# Altium schematic sheet power_supply.SchDoc
size A4
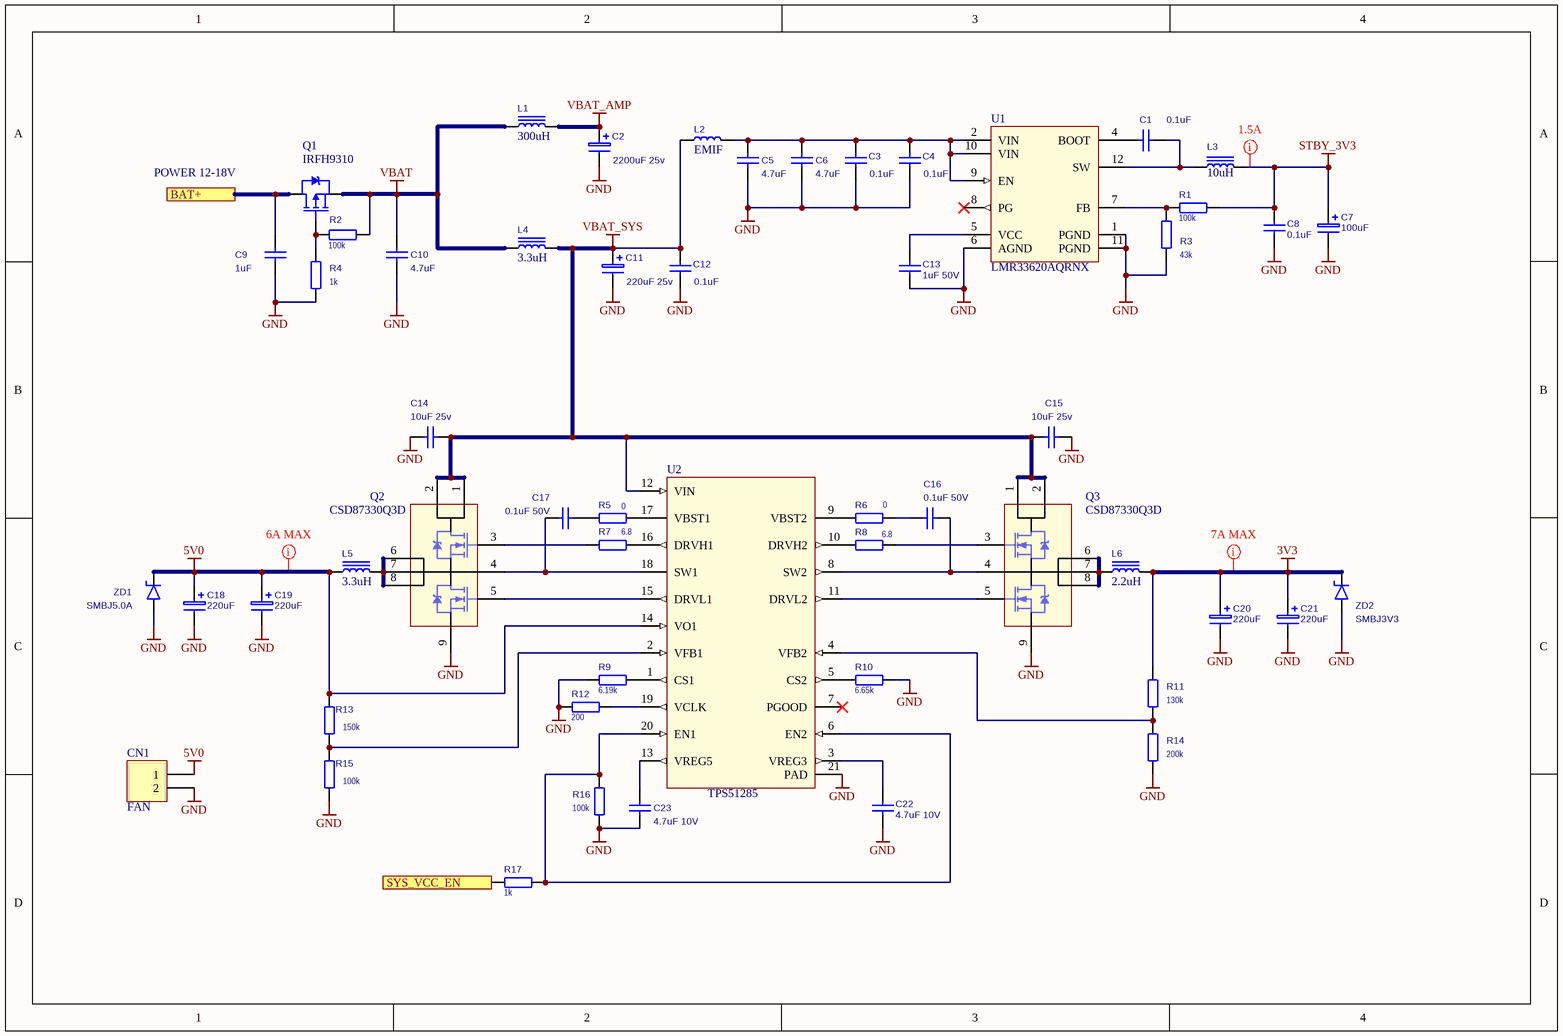
[diagram p0: power_supply.SchDoc]

## Parts
C1  value 0.1uF  [C0603]  (hidden comment: C1608X7R1H104K080AA)
C2  value 2200uF 25v  [R12H05]  (hidden comment: EEU-FC1V222)
C3  value 0.1uF  [C0603]  (hidden comment: C1608X7R1H104K080AA)
C4  value 0.1uF  [C0603]  (hidden comment: C1608X7R1H104K080AA)
C5  value 4.7uF  [C0603]  (hidden comment: GRM188R61E475KE11D)
C6  value 4.7uF  [C0603]  (hidden comment: GRM188R61E475KE11D)
C7  value 100uF  [TANTAL-B-1411]  (hidden comment: 6TPE100MPB)
C8  value 0.1uF  [C0603]  (hidden comment: C1608X7R1H104K080AA)
C9  value 1uF  [C0603]  (hidden comment: CC0603KRX7R9BB105)
C10  value 4.7uF  [C0603]  (hidden comment: GRM188R61E475KE11D)
C11  value 220uF 25v  [R08H04]  (hidden comment: ECAP 220/25V 0812 105'C)
C12  value 0.1uF  [C0603]  (hidden comment: C1608X7R1H104K080AA)
C13  value 1uF 50V  [C0603]  (hidden comment: CC0603KRX7R9BB105)
C14  value 10uF 25v  [C0805]  (hidden comment: GRM21BR61E106KA73L)
C15  value 10uF 25v  [C0805]  (hidden comment: GRM21BR61E106KA73L)
C16  value 0.1uF 50V  [C0603]  (hidden comment: C1608X7R1H104K080AA)
C17  value 0.1uF 50V  [C0603]  (hidden comment: C1608X7R1H104K080AA)
C18  value 220uF  [TANTAL-D-2916]  (hidden comment: 6TPE220MI)
C19  value 220uF  [TANTAL-D-2916]  (hidden comment: 6TPE220MI)
C20  value 220uF  [TANTAL-D-2916]  (hidden comment: 6TPE220MI)
C21  value 220uF  [TANTAL-D-2916]  (hidden comment: 6TPE220MI)
C22  value 4.7uF 10V  [C0603]  (hidden comment: CL10A475KP8NNNC)
C23  value 4.7uF 10V  [C0603]  (hidden comment: CL10A475KP8NNNC)
CN1  FAN  [MW-2M]
L1  value 300uH  [IND_COIL_TH_33x18]  (hidden comment: ATCA-06-301M)
L2  value EMIF  [IND0805]  (hidden comment: BLM21PG221SN1D)
L3  value 10uH  [CDRH6D28]  (hidden comment: CDRH6D38NP-100NC)
L4  value 3.3uH  [IHLP-2525CZ]  (hidden comment: IHLP2525CZER3R3M01)
L5  value 3.3uH  [IHLP-2525CZ]  (hidden comment: IHLP2525CZER3R3M01)
L6  value 2.2uH  [IHLP-2525CZ]  (hidden comment: IHLP2525CZER2R2M01)
Q1  IRFH9310  [PQFN_5X6]
Q2  CSD87330Q3D  [SON-8-3.3X3.3]
Q3  CSD87330Q3D  [SON-8-3.3X3.3]
R1  100k  [R0603]
R2  100k  [R0603]
R3  43k  [R0603]
R4  1k  [R0603]
R5  0  [R0603]
R6  0  [R0603]
R7  value 6.8  [R0603]  (hidden comment: RES 0603 6R8 5%)
R8  value 6.8  [R0603]  (hidden comment: RES 0603 6R8 5%)
R9  6.19k  [R0603]
R10  6.65k  [R0603]
R11  130k  [R0603]
R12  200  [R0603]
R13  150k  [R0603]
R14  200k  [R0603]
R15  100k  [R0603]
R16  100k  [R0603]
R17  1k  [R0603]
U1  LMR33620AQRNX  [VQFN-HR-12]
U2  TPS51285  [WQFN-20]
ZD1  value SMBJ5.0A  [SMB]  (hidden comment: SMBJ5.0A-TR)
ZD2  SMBJ3V3  [SMB]

## Ports
BAT+, SYS_VCC_EN

## Nets
3V3: C20.1(+) C21.1(+) L6.2 R11.1 ZD2.2(K)
5V0: C18.1(+) C19.1(+) CN1.1 L5.1 R13.1 U2.14(VO1) ZD1.2(K)
GND: C2.2(-) C3.2 C4.2 C5.1 C6.1 C7.2(-) C8.2 C9.1 C10.1 C11.2(-) C12.2 C13.1 C14.1 C15.2 C18.2(-) C19.2(-) C20.2(-) C21.2(-) C22.2 C23.2 CN1.2 Q2.9(GND) Q3.9(GND) R3.2 R4.2 R9.1 R10.2 R12.1 R14.2 R15.2 R16.1 U1.1(PGND) U1.6(AGND) U1.11(PGND) U2.21(PAD) ZD1.1(A) ZD2.1(A)
STBY_3V3: C7.1(+) C8.1 L3.2 R1.2
VBAT: C10.2 L1.1 L4.1 Q1.2(S) R2.2
VBAT_AMP: C2.1(+) L1.2
VBAT_SYS: C11.1(+) C12.1 C14.2 C15.1 L2.2 L4.2 Q2.1(VIN) Q2.2 Q3.1(VIN) Q3.2 U2.12(VIN)
BAT+: C9.2 Q1.3(D) ; port BAT+
SYS_VCC_EN: R17.1 ; port SYS_VCC_EN
NetC1_1: C1.1 L3.1 U1.12(SW)
NetC1_2: C1.2 U1.4(BOOT)
NetC3_1: C3.1 C4.1 C5.2 C6.2 L2.1 U1.2(VIN) U1.9(EN) U1.10(VIN)
NetC13_2: C13.2 U1.5(VCC)
NetC16_1: C16.1 R6.1
NetC16_2: C16.2 Q3.4(TGR) U2.8(SW2)
NetC17_1: C17.1 R5.1
NetC17_2: C17.2 Q2.4(TGR) U2.18(SW1)
NetC22_1: C22.1 U2.3(VREG3)
NetC23_1: C23.1 U2.13(VREG5)
NetL5_2: L5.2 Q2.6(VSW) Q2.7(VSW) Q2.8(VSW)
NetL6_1: L6.1 Q3.6(VSW) Q3.7(VSW) Q3.8(VSW)
NetQ1_1: Q1.1(G) R2.1 R4.1
NetQ2_3: Q2.3(TG) R7.1
NetQ2_5: Q2.5(BG) U2.15(DRVL1)
NetQ3_3: Q3.3(TG) R8.1
NetQ3_5: Q3.5(BG) U2.11(DRVL2)
NetR1_1: R1.1 R3.1 U1.7(FB)
NetR5_2: R5.2 U2.17(VBST1)
NetR6_2: R6.2 U2.9(VBST2)
NetR7_2: R7.2 U2.16(DRVH1)
NetR8_2: R8.2 U2.10(DRVH2)
NetR9_2: R9.2 U2.1(CS1)
NetR10_1: R10.1 U2.5(CS2)
NetR11_2: R11.2 R14.1 U2.4(VFB2)
NetR12_2: R12.2 U2.19(VCLK)
NetR13_2: R13.2 R15.1 U2.2(VFB1)
NetR16_2: R16.2 R17.2 U2.6(EN2) U2.20(EN1)

Not connected (* = marked no-connect by the designer): U1 8(PG)*; U2 7(PGOOD)*

## Layout directives
mark named 1.5A: STBY_3V3
mark named 6A MAX: 5V0
mark named 7A MAX: 3V3

## Notes on the sheet
- POWER 12-18V

## Library data of the parts
C1 C3-C6 C8-C10 C12-C17 C22 C23 = CAP_NPOL
C2 C7 C11 C18-C21 = CAP_POL
CN1 = HDR 2: Header, 2-Pin; LatestRevisionDate: 17-Jul-2002; LatestRevisionNote: Re-released for DXP Platform.; Publisher: Altium Limited
L1 L3-L6 = IND_W_IRON
L2 = IND_WO_IRON
Q1 = P-Channel: HEXFET Power MOSFET; Value: IRFH9310
Q2 Q3 = CSD87330Q3D: Synchronous Buck NexFET™ Power Block
R1-R17 = RESISTOR: RES
  R1 R2 R15 R16: Value: 100k
  R3: Value: 43k
  R4 R17: Value: 1k
  R5 R6: Value: 0
  R9: Value: 6.19k
  R10: Value: 6.65k
  R11: Value: 130k
  R12: Value: 200
  R13: Value: 150k
  R14: Value: 200k
U1 = LMR33620-Q1: 3.8-V to 36-V, 2-A Synchronous step-down voltage converter; value: TPS54232
U2 = TPS51285: Ultra-Low Quiescent (ULQ™) Dual Synchronous Step-Down Controller with / 5V and 3.3V LDOs; value: TPS53127RG
ZD1 ZD2 = ZENNER: Zenner diode
  ZD2: Value: SMBJ3V3